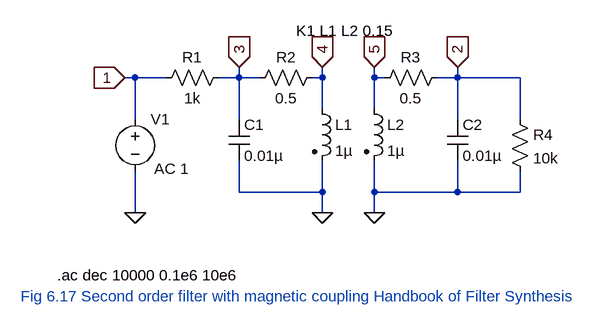
[diagram p0: schematic SMNA_example.asc]
SMNA_example.asc, the LTspice schematic file:
Version 4
SHEET 1 1020 680
WIRE -224 -64 -240 -64
WIRE -176 -64 -224 -64
WIRE -64 -64 -64 -80
WIRE -64 -64 -96 -64
WIRE -32 -64 -64 -64
WIRE 64 -64 64 -80
WIRE 64 -64 48 -64
WIRE 144 -64 144 -80
WIRE 160 -64 144 -64
WIRE 272 -64 272 -80
WIRE 272 -64 240 -64
WIRE 368 -64 272 -64
WIRE 64 -16 64 -64
WIRE 144 -16 144 -64
WIRE -224 0 -224 -64
WIRE -64 0 -64 -64
WIRE 272 0 272 -64
WIRE 368 0 368 -64
WIRE -64 112 -64 64
WIRE 64 112 64 64
WIRE 64 112 -64 112
WIRE 144 112 144 64
WIRE 272 112 272 64
WIRE 272 112 144 112
WIRE 368 112 368 80
WIRE 368 112 272 112
WIRE -224 144 -224 80
WIRE 64 144 64 112
WIRE 144 144 144 112
FLAG -224 144 0
FLAG 144 144 0
FLAG 64 144 0
FLAG -64 -80 3
IOPIN -64 -80 In
FLAG 64 -80 4
IOPIN 64 -80 In
FLAG 144 -80 5
IOPIN 144 -80 In
FLAG 272 -80 2
IOPIN 272 -80 In
FLAG -240 -64 1
IOPIN -240 -64 In
SYMBOL voltage -224 -16 R0
WINDOW 123 29 92 Left 2
WINDOW 39 0 0 Left 0
SYMATTR Value2 AC 1
SYMATTR InstName V1
SYMATTR Value ""
SYMBOL res -80 -80 R90
WINDOW 0 0 56 VBottom 2
WINDOW 3 32 56 VTop 2
SYMATTR InstName R1
SYMATTR Value 1k
SYMBOL res 352 -16 R0
SYMATTR InstName R4
SYMATTR Value 10k
SYMBOL cap -80 0 R0
SYMATTR InstName C1
SYMATTR Value 0.01µ
SYMBOL cap 256 0 R0
SYMATTR InstName C2
SYMATTR Value 0.01µ
SYMBOL ind2 48 -32 R0
SYMATTR InstName L1
SYMATTR Value 1µ
SYMATTR Type ind
SYMBOL ind2 128 -32 R0
SYMATTR InstName L2
SYMATTR Value 1µ
SYMATTR Type ind
SYMBOL res 64 -80 R90
WINDOW 0 0 56 VBottom 2
WINDOW 3 32 56 VTop 2
SYMATTR InstName R2
SYMATTR Value 0.5
SYMBOL res 256 -80 R90
WINDOW 0 0 56 VBottom 2
WINDOW 3 32 56 VTop 2
SYMATTR InstName R3
SYMATTR Value 0.5
TEXT -344 240 Left 2 !.ac dec 10000 0.1e6 10e6
TEXT -400 272 Left 2 ;Fig 6.17 Second order filter with magnetic coupling Handbook of Filter Synthesis
TEXT 24 -136 Left 2 !K1 L1 L2 0.15

The netlist it stands for:
* SMNA_example.asc
V1 1 0 AC 1
R1 3 1 1k
R4 2 0 10k
C1 3 0 0.01µ
C2 2 0 0.01µ
L1 4 0 1µ
L2 5 0 1µ
R2 4 3 0.5
R3 2 5 0.5
.ac dec 10000 0.1e6 10e6
* Fig 6.17 Second order filter with magnetic coupling Handbook of Filter Synthesis
K1 L1 L2 0.15
.backanno
.end